# Altium project Wolf-Lite_UM.PrjPCB
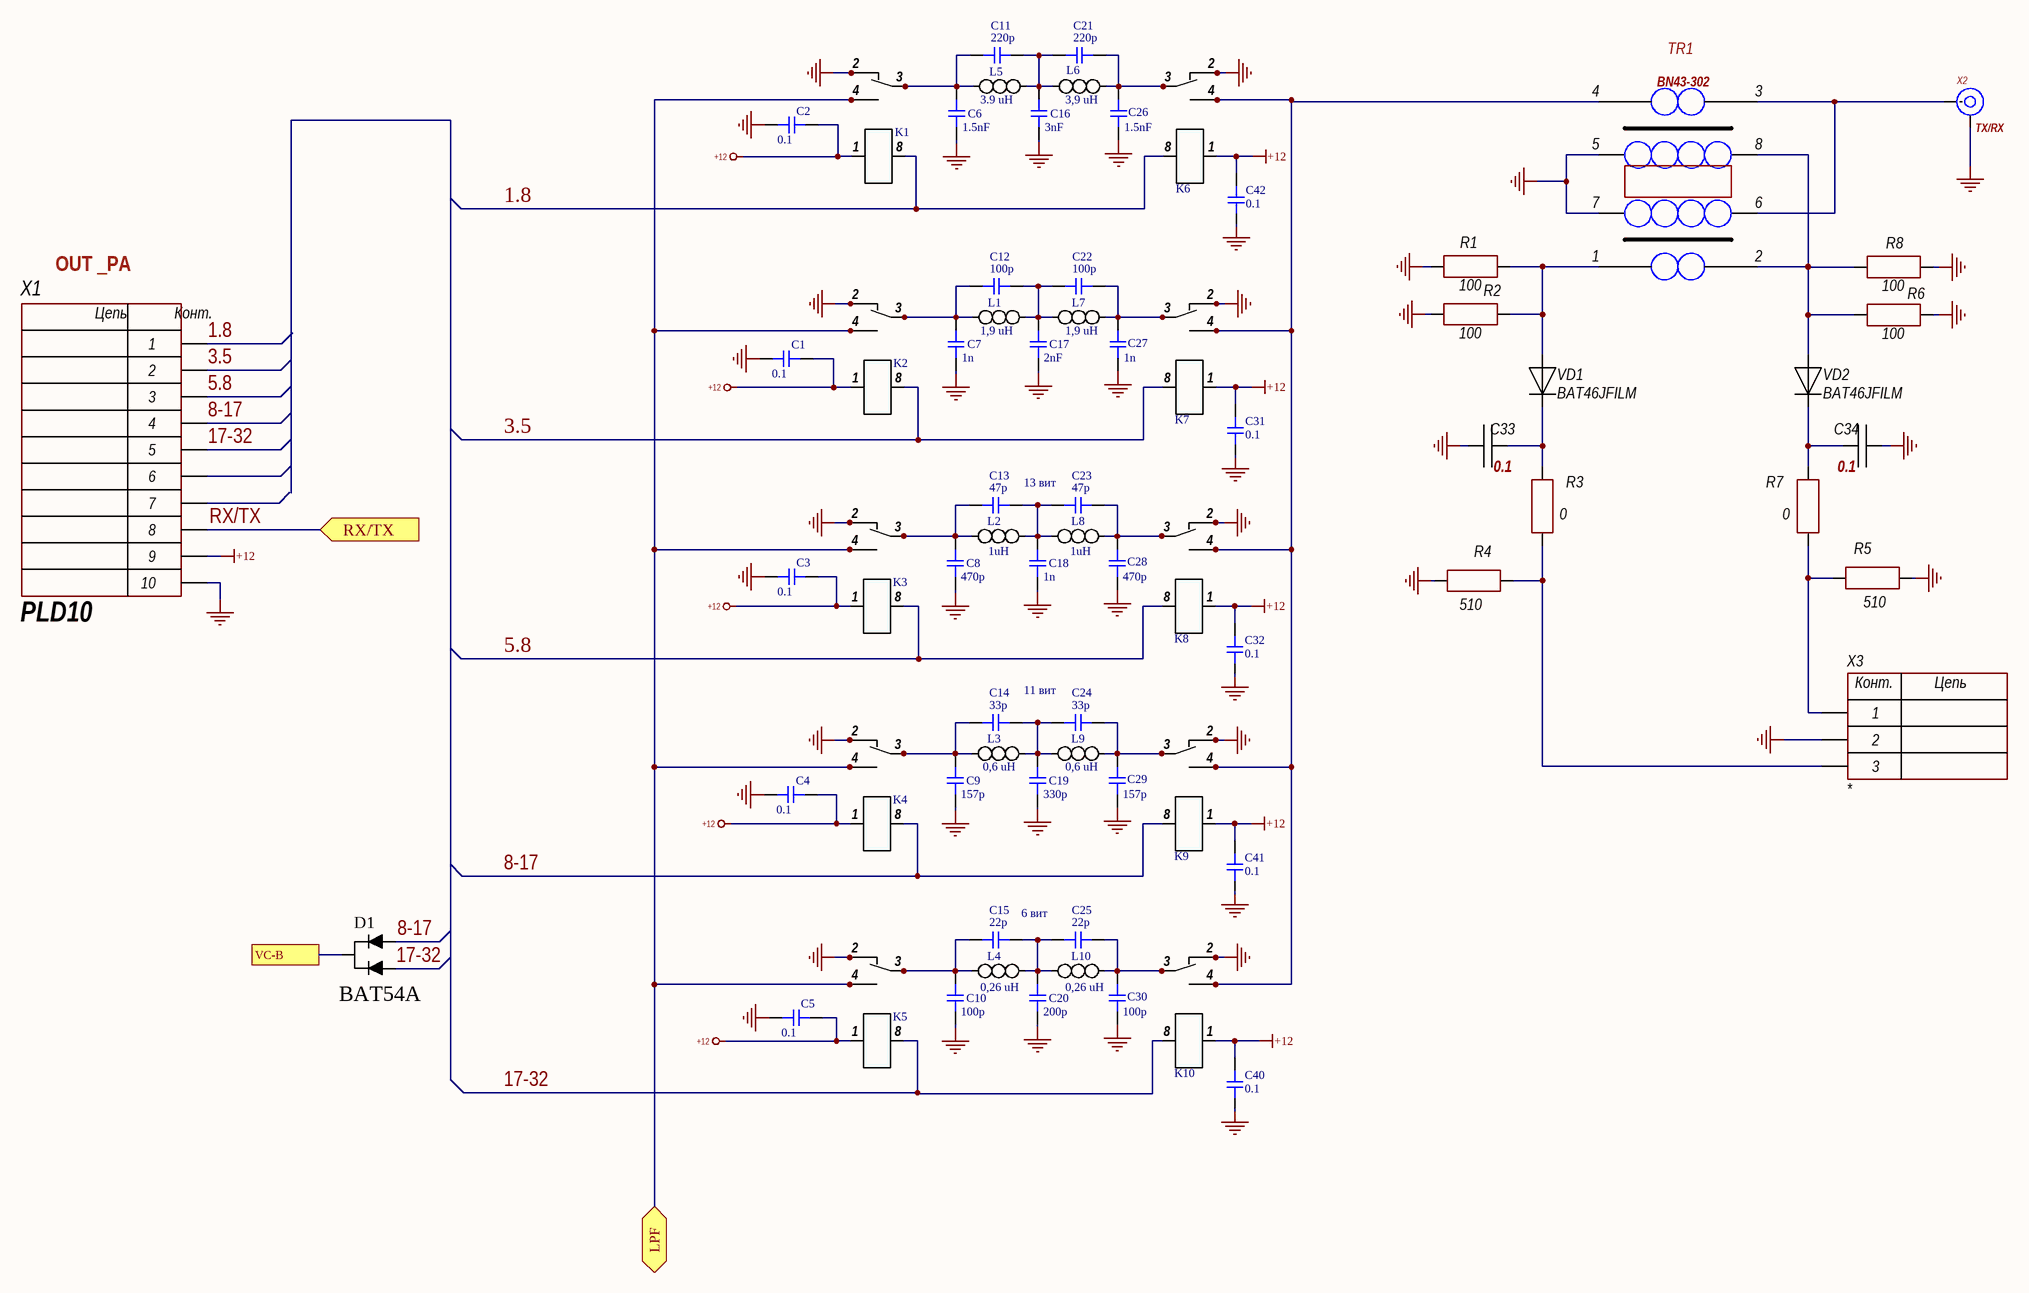
[diagram p0: Wolf-Lite_LPF.SchDoc]
2 sheets, 150 parts. Net scope: flat (ports and power ports of the same name join across sheets).
Board file: Wolf-Lite_UM.PcbDoc
Sheets:
  Wolf-Lite_LPF.SchDoc
  Wolf-Lite_UM.SchDoc

## Sheet Wolf-Lite_LPF.SchDoc
size 594 x 420 mm; Address1: Address1; Address2: Address2; Address3: Address3; Address4: Address4; DocumentNumber: АБВГ.123456.001 Э3; SheetNumber: 2; Scale: 1:1; DocumentType: Схема электрическая принципиальная; FirstReferrence: АБВГ.123456.001

### Parts
(Parts that share a designator on the sheet are numbered #1, #2 ... from top to bottom, then left to right.)
C1  0.1  [CH0805C]
C2  0.1  [CH0805C]
C3  0.1  [CH0805C]
C4  0.1  [CH0805C]
C5  0.1  [CH0805C]
C6  1.5nF  [CH1206C]
C7  1n  [CH1206C]
C8  470p  [CH1206C]
C9  157p  [CH1206C]
C10  100p  [CH1206C]
C11  220p  [CH1206C]
C12  100p  [CH1206C]
C13  47p  [CH1206C]
C14  33p  [CH1206C]
C15  22p  [CH1206C]
C16  3nF  [CH1206C]
C17  2nF  [CH1206C]
C18  1n  [CH1206C]
C19  330p  [CH1206C]
C20  200p  [CH1206C]
C21  220p  [CH1206C]
C22  100p  [CH1206C]
C23  47p  [CH1206C]
C24  33p  [CH1206C]
C25  22p  [CH1206C]
C26  1.5nF  [CH1206C]
C27  1n  [CH1206C]
C28  470p  [CH1206C]
C29  157p  [CH1206C]
C30  100p  [CH1206C]
C31  0.1  [CH0805C]
C32  0.1  [CH0805C]
C33  0.1  [CH0805C]
C34  0.1  [CH0805C]
C40  0.1  [CH0805C]
C41  0.1  [CH0805C]
C42  0.1  [CH0805C]
D1  BAT54A  [SOT23_132]
K1  Relay_IM06 GR 12v to BPF  [IM06]  (value not drawn)
K2  Relay_IM06 GR 12v to BPF  [IM06]  (value not drawn)
K3  Relay_IM06 GR 12v to BPF  [IM06]  (value not drawn)
K4  Relay_IM06 GR 12v to BPF  [IM06]  (value not drawn)
K5  Relay_IM06 GR 12v to BPF  [IM06]  (value not drawn)
K6  Relay_IM06 GR 12v to BPF  [IM06]  (value not drawn)
K7  Relay_IM06 GR 12v to BPF  [IM06]  (value not drawn)
K8  Relay_IM06 GR 12v to BPF  [IM06]  (value not drawn)
K9  Relay_IM06 GR 12v to BPF  [IM06]  (value not drawn)
K10  Relay_IM06 GR 12v to BPF  [IM06]  (value not drawn)
L1  1,9 uH  [T50-2]
L2  1uH  [T50-6]
L3  0,6 uH  [T50-6]
L4  0,26 uH  [T50-6]
L5  3.9 uH  [T50-2]
L6  3,9 uH  [T50-2]
L7  1,9 uH  [T50-2]
L8  1uH  [T50-6]
L9  0,6 uH  [T50-6]
L10  0,26 uH  [T50-6]
R1  100  [CH1206R]
R2  100  [CH1206R]
R3  0  [CH0805R]
R4  510  [CH0805R]
R5  510  [CH0805R]
R6  100  [CH1206R]
R7  0  [CH0805R]
R8  100  [CH1206R]
TR1  BN43-302  [TANDEM]
VD1  BAT46JFILM  [D9B]
VD2  BAT46JFILM  [D9B]
X1#1  PLD10  [CON: PLD-10]
X2  TX/RX  [Connect]
X3  *  [CON: CWF-3]

### Ports
LPF (bidir), RX/TX (in), VC-B

### Nets
+12: C1.2 C2.2 C3.2 C4.2 C5.2 C31.2 C32.2 C40.2 C41.2 C42.2 K1.1 K2.1 K3.1 K4.1 K5.1 K6.1 K7.1 K8.1 K9.1 K10.1 X1#1.9
GND: C1.1 C2.1 C3.1 C4.1 C5.1 C6.2 C7.2 C8.2 C9.2 C10.2 C16.2 C17.2 C18.2 C19.2 C20.2 C26.2 C27.2 C28.2 C29.2 C30.2 C31.1 C32.1 C33.2 C34.2 C40.1 C41.1 C42.1 K1.2 K1.7 K2.2 K2.7 K3.2 K3.7 K4.2 K4.7 K5.2 K5.7 K6.2 K6.7 K7.2 K7.7 K8.2 K8.7 K9.2 K9.7 K10.2 K10.7 R1.2 R2.2 R4.1 R5.1 R6.2 R8.2 TR1.5 TR1.7 X1#1.10 X2.2(IN) X3.2
1.8: K1.8 K6.8 X1#1.1
3.5: K2.8 K7.8 X1#1.2
5.8: K3.8 K8.8 X1#1.3
8-17: D1.1 K4.8 K9.8 X1#1.4
17-32: D1.2 K5.8 K10.8 X1#1.5
LPF: K1.4 K1.5 K2.4 K2.5 K3.4 K3.5 K4.4 K4.5 K5.4 K5.5 ; port LPF
RX/TX: X1#1.8 ; port RX/TX
NetC6_1: C6.1 C11.2 K1.3 K1.6 L5.1
NetC7_1: C7.1 C12.2 K2.3 K2.6 L1.1
NetC8_1: C8.1 C13.2 K3.3 K3.6 L2.1
NetC9_1: C9.1 C14.2 K4.3 K4.6 L3.1
NetC10_1: C10.1 C15.2 K5.3 K5.6 L4.1
NetC11_1: C11.1 C16.1 C21.2 L5.2 L6.1
NetC12_1: C12.1 C17.1 C22.2 L1.2 L7.1
NetC13_1: C13.1 C18.1 C23.2 L2.2 L8.1
NetC14_1: C14.1 C19.1 C24.2 L3.2 L9.1
NetC15_1: C15.1 C20.1 C25.2 L4.2 L10.1
NetC21_1: C21.1 C26.1 K6.3 K6.6 L6.2
NetC22_1: C22.1 C27.1 K7.3 K7.6 L7.2
NetC23_1: C23.1 C28.1 K8.3 K8.6 L8.2
NetC24_1: C24.1 C29.1 K9.3 K9.6 L9.2
NetC25_1: C25.1 C30.1 K10.3 K10.6 L10.2
NetC33_1: C33.1 R3.1 VD1.2
NetC34_1: C34.1 R7.1 VD2.2
NetC78_1: D1.3 ; port VC-B
NetK6_4: K6.4 K6.5 K7.4 K7.5 K8.4 K8.5 K9.4 K9.5 K10.4 K10.5 TR1.4
NetR1_1: R1.1 R2.1 TR1.1 VD1.1
NetR3_2: R3.2 R4.2 X3.3
NetR5_2: R5.2 R7.2 X3.1
NetR6_1: R6.1 R8.1 TR1.2 TR1.8 VD2.1
NetTR1_3: TR1.3 TR1.6 X2.1(IN)

Not connected (* = marked no-connect by the designer): X1#1 6 7

### Notes on the sheet
- OUT _PA
- 13 вит
- 11 вит
- 6 вит
- Перв. примен.
- Справ. №
- Подп. и дата
- Инв. № дубл.
- Взам. инв. №
- Инв. № подл.
- Изм.
- Лист
- № докум.
- Подп.
- Дата
- 2.106-A2
- Копировал
- Формат А2
- (in symbol 3-Connector) Конт.; Цепь
- (in symbol 10-Connector) Цепь; Конт.

### Library data of the parts
C1-C32 C40-C42 = C_smd
C33 C34 = Capacitor: Manufacturer: *; Model: *; HelpURL: *; ComponentKind: *; Value: *
D1 = BAT54
L1-L10 = L
R1-R8 = Resistor: Manufacturer: *; Model: *; HelpURL: *; ComponentKind: *; Value: *
VD1 VD2 = Diod: ComponentKind: *; Manufacturer: *; Model: *; HelpURL: *
X1#1 = 10-Connector: Model: *; Manufacturer: *; HelpURL: *; ComponentKind: *
X2 = SMA: RF; System: Connector; Model: *; Manufacturer: *; HelpURL: *; ComponentKind: *
X3 = 3-Connector: Model: *; Manufacturer: *; HelpURL: *; ComponentKind: *

## Sheet Wolf-Lite_UM.SchDoc
size A3; Address1: Address1; Address2: Address2; Address3: Address3; Address4: Address4; DocumentNumber: АБВГ.123456.001 Э3; SheetNumber: 1; Scale: 1:1; DocumentType: Схема электрическая принципиальная; FirstReferrence: АБВГ.123456.001
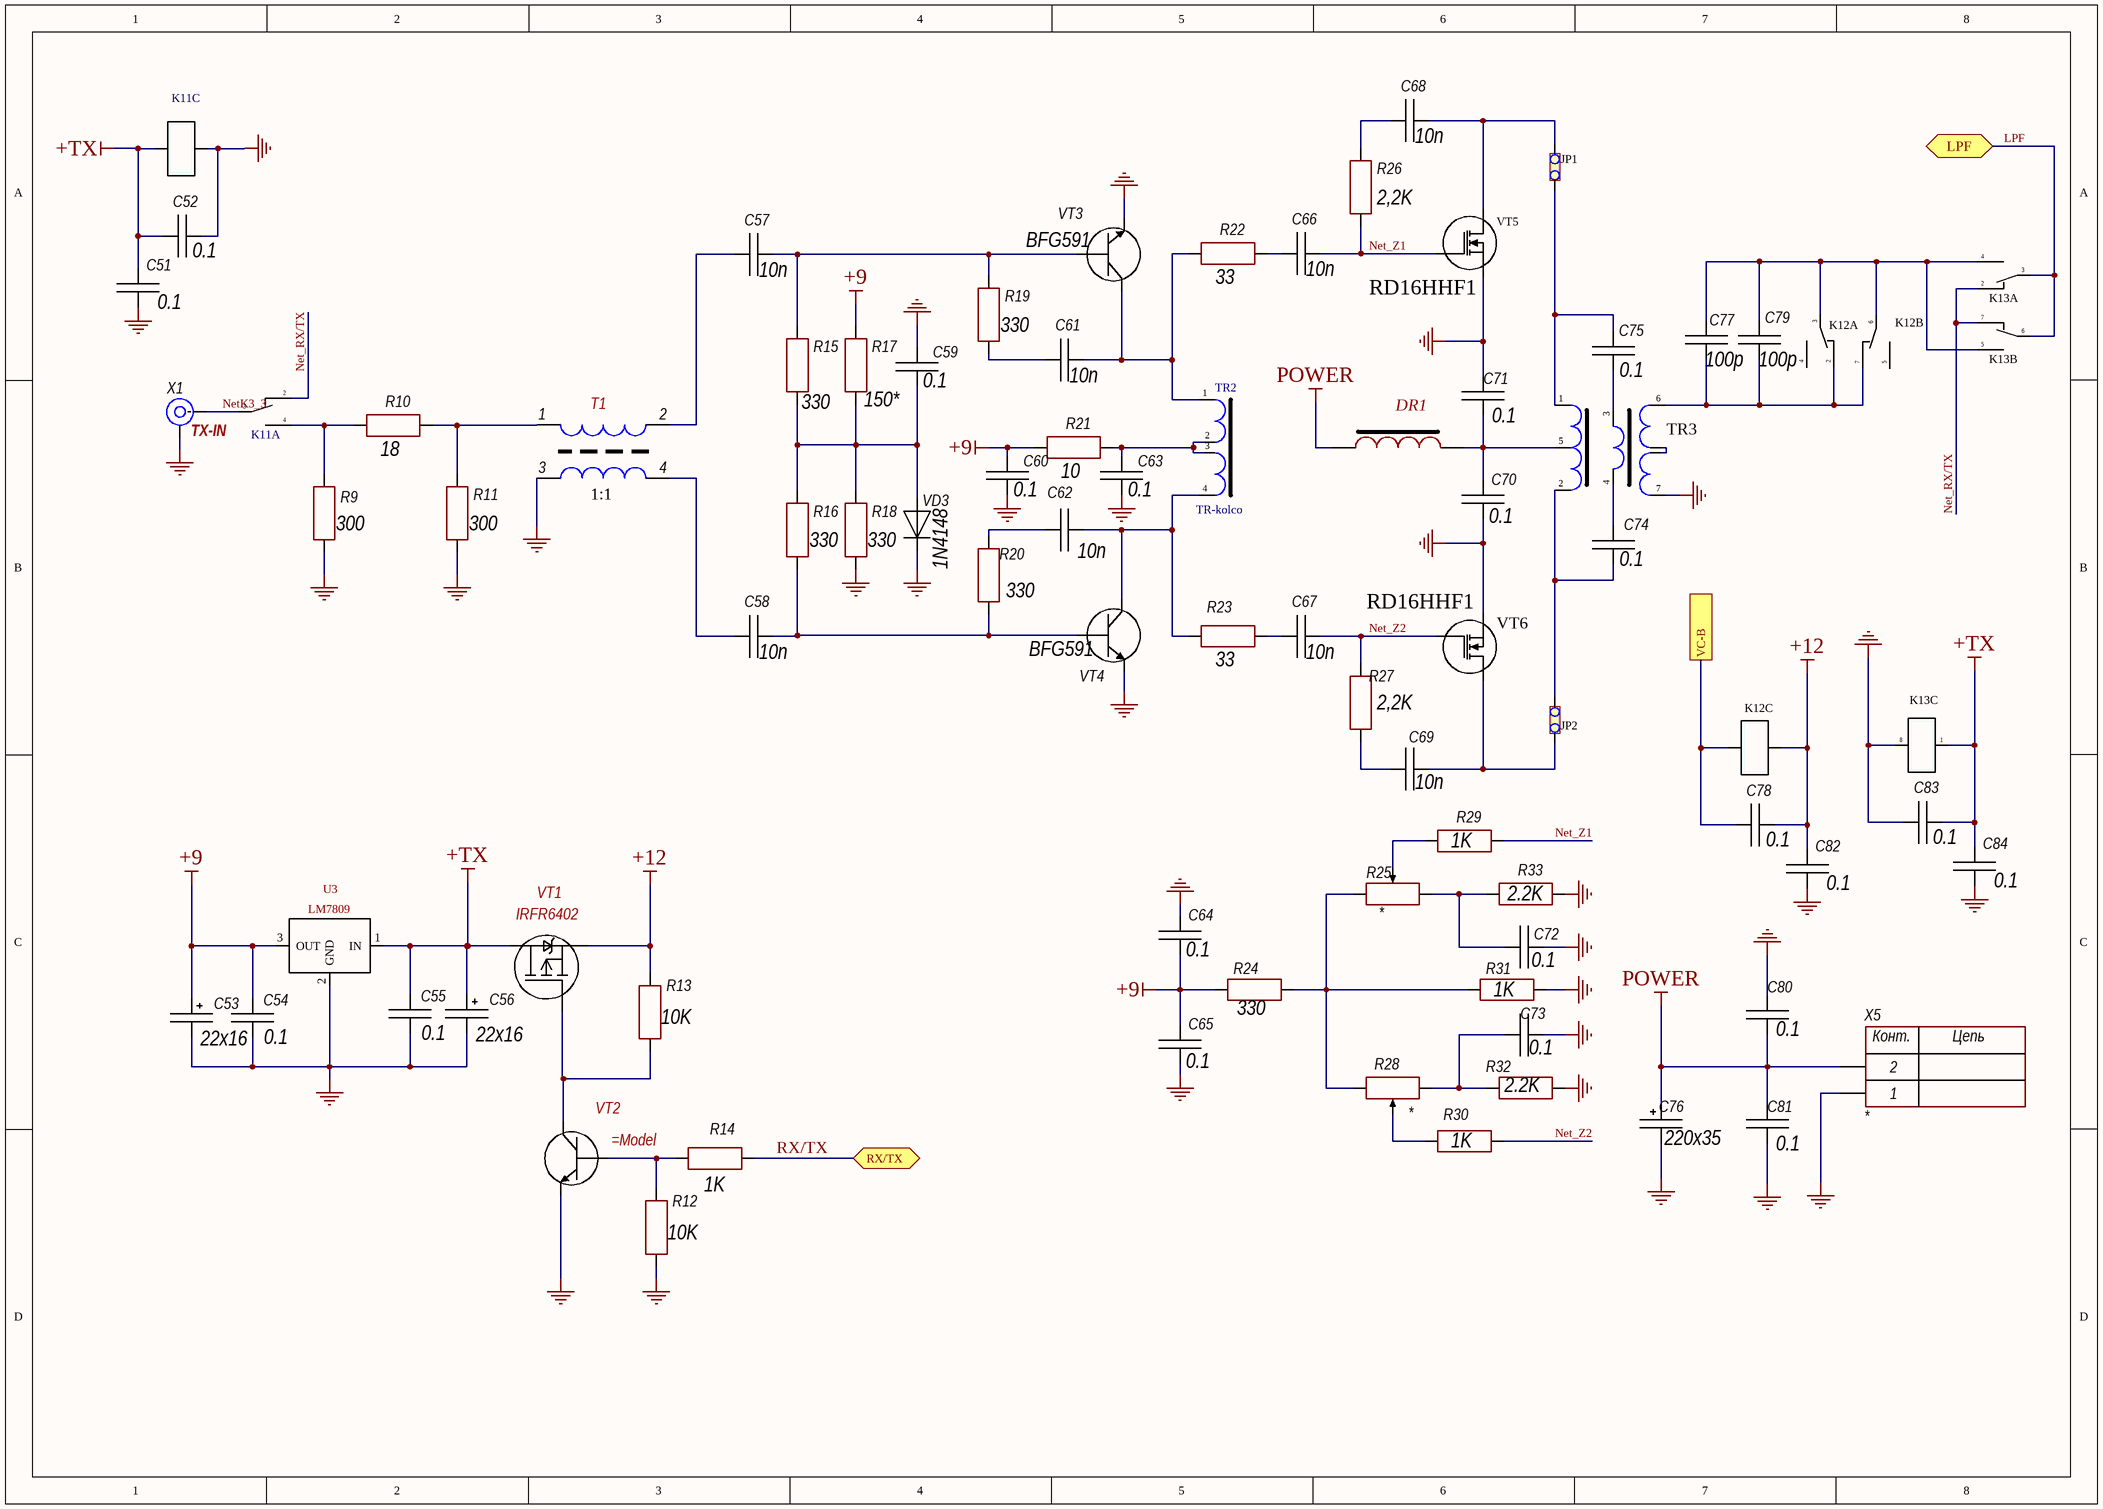
[diagram p1: Wolf-Lite_UM.SchDoc]

### Parts
(Parts that share a designator on the sheet are numbered #1, #2 ... from top to bottom, then left to right.)
C51  0.1  [CH0805C]
C52  0.1  [CH0805C]
C53  22x16  [TANTAL_B]
C54  0.1  [CH0805C]
C55  0.1  [CH0805C]
C56  22x16  [TANTAL_B]
C57  10n  [CH0805C]
C58  10n  [CH0805C]
C59  0.1  [CH0805C]
C60  0.1  [CH0805C]
C61  10n  [CH0805C]
C62  10n  [CH0805C]
C63  0.1  [CH0805C]
C64  0.1  [CH0805C]
C65  0.1  [CH0805C]
C66  10n  [CH0805C]
C67  10n  [CH0805C]
C68  10n  [CH1206C]
C69  10n  [CH1206C]
C70  0.1  [CH0805C]
C71  0.1  [CH0805C]
C72  0.1  [CH0805C]
C73  0.1  [CH0805C]
C74  0.1  [CH1206C]
C75  0.1  [CH1206C]
C76  220x35  [D8C3.2H12]
C77  100p  [CH1206C]
C78  0.1  [CH0805C]
C79  100p  [CH1206C]
C80  0.1  [CH0805C]
C81  0.1  [CH0805C]
C82  0.1  [CH0805C]
C83  0.1  [CH0805C]
C84  0.1  [CH0805C]
DR1  10uH  [DR2]  (value not drawn)
JP1  JP1  [CON: PLS-2]  (value not drawn)
JP2  JP2  [CON: PLS-2]  (value not drawn)
K11  IM06  [IMG06]  (value not drawn)  (parts A,C of 3)
K12  IM06  [IMG06]  (value not drawn)  (parts A,B,C of 3)
K13  IM06  [IMG06]  (value not drawn)  (parts A,B,C of 3)
R9  300  [CH0805R]
R10  18  [CH0805R]
R11  300  [CH0805R]
R12  10K  [CH0805R]
R13  10K  [CH0805R]
R14  1K  [CH0805R]
R15  330  [CH0805R]
R16  330  [CH0805R]
R17  150*  [CH0805R]
R18  330  [CH0805R]
R19  330  [CH0805R]
R20  330  [CH0805R]
R21  10  [CH0805R]
R22  33  [CH0805R]
R23  33  [CH0805R]
R24  330  [CH0805R]
R25  *  [RES: 3296W]
R26  2,2K  [CH1206R]
R27  2,2K  [CH1206R]
R28  *  [RES: 3296W]
R29  1K  [CH0805R]
R30  1K  [CH0805R]
R31  1K  [CH0805R]
R32  2.2K  [CH0805R]
R33  2.2K  [CH0805R]
T1  BN-43-302  [FT-37-43]  (value not drawn)
TR2  TR-kolco  [TR-Kolco]
TR3  TR-UM  [TR-UM]  (value not drawn)
U3  LM7809  [DPAK]
VD3  1N4148  [SOD123]
VT1  IRFR6402  [SOT23_132]
VT2  (no value)  [SOT23_123]
VT3  BFG591  [BFG]
VT4  BFG591  [BFG]
VT5  RD16HHF1  [rd16]
VT6  RD16HHF1  [rd16]
X1#2  TX-IN  [CON: SMA]
X5  *  [CON: 300-02P-5.0]

### Ports
LPF (bidir), RX/TX (bidir), VC-B

### Nets
+9: C53.1 C54.2 C60.2 C64.1 C65.1 R17.2 R21.1 R24.1 U3.3(OUT)
+12: C78.2 C82.2 K12.1 R13.2 VT1.2(I)
+TX: C51.2 C52.1 C55.2 C56.1 C83.2 C84.2 K11.1 K13.1 U3.1(IN) VT1.3(Сток(Drain))
GND: C51.1 C52.2 C53.2 C54.1 C55.1 C56.2 C59.2 C60.1 C63.1 C64.2 C65.2 C70.2 C71.2 C72.1 C73.1 C76.2 C80.1 C81.1 C82.1 C83.1 C84.1 K11.8 K13.8 R9.1 R11.1 R12.1 R18.1 R31.2 R32.2 R33.2 T1.3 TR3.7 U3.2(GND) VD3.2 VT2.3(E) VT3.3(E) VT4.3(E) VT5.2(S) VT6.2(S) X1#2.2(IN) X5.1
POWER: C76.1 C80.2 C81.2 DR1.2 X5.2
LPF: K13.3 K13.6 ; port LPF
Net_RX/TX: K11.2 K13.2 K13.7
Net_Z1: C66.2 R26.1 R29.2 VT5.1(G)
Net_Z2: C67.2 R27.1 R30.2 VT6.1(G)
NetK3_3: K11.3 X1#2.1(IN)
RX/TX: R14.1 ; port RX/TX
NetC57_1: C57.1 T1.2
NetC57_2: C57.2 R15.2 R19.2 VT3.2(B)
NetC58_1: C58.1 T1.4
NetC58_2: C58.2 R16.1 R20.2 VT4.2(B)
NetC59_1: C59.1 R15.1 R16.2 R17.1 R18.2 VD3.1
NetC61_1: C61.1 R19.1
NetC61_2: C61.2 R22.1 TR2.1 VT3.1(C)
NetC62_1: C62.1 R20.1
NetC62_2: C62.2 R23.1 TR2.4 VT4.1(C)
NetC63_2: C63.2 R21.2 TR2.2 TR2.3
NetC66_1: C66.1 R22.2
NetC67_1: C67.1 R23.2
NetC68_1: C68.1 R26.2
NetC68_2: C68.2 JP1.1 VT5.3(D)
NetC69_1: C69.1 R27.2
NetC69_2: C69.2 JP2.1 VT6.3(D)
NetC70_1: C70.1 C71.1 DR1.1 TR3.5
NetC72_2: C72.2 R25.3 R33.1
NetC73_2: C73.2 R28.3 R32.1
NetC74_1: C74.1 JP2.2 TR3.2
NetC74_2: C74.2 TR3.4
NetC75_1: C75.1 JP1.2 TR3.1
NetC75_2: C75.2 TR3.3
NetC77_1: C77.1 C79.1 K12.3 K12.6 K13.4 K13.5
NetC77_2: C77.2 C79.2 K12.2 K12.7 TR3.6
NetC78_1: C78.1 K12.8 ; port VC-B
NetK11_4: K11.4 R9.2 R10.1
NetR10_2: R10.2 R11.2 T1.1
NetR12_2: R12.2 R14.2 VT2.1(B)
NetR13_1: R13.1 VT1.1(Затвор(Gate)) VT2.2(C)
NetR24_2: R24.2 R25.1 R28.1 R31.1
NetR25_2: R25.2 R29.1
NetR28_2: R28.2 R30.1
NetTR3_8: TR3.8 TR3.9

Not connected (* = marked no-connect by the designer): K12 4 5

### Notes on the sheet
- (near T1) 1:1
- Title
- Size:
- Date:
- A3
- Number:
- Time:
- Revision:
- Sheet
- of
- File:
- (in symbol 2-Connector) Конт.; Цепь

### Library data of the parts
C51 C52 C54 C55 C57-C75 C77-C84 = Capacitor: Manufacturer: *; Model: *; HelpURL: *; ComponentKind: *; Value: *
C53 C56 C76 = AlumCap: Manufacturer: *; Model: *; HelpURL: *; ComponentKind: *; Value: *
DR1 = Inductor-1
JP1 = JP2
K11-K13 = IM06-1
R9-R24 R26 R27 R29-R33 = Resistor: Manufacturer: *; Model: *; HelpURL: *; ComponentKind: *; Value: *
R25 R28 = ADJ resistor: Manufacturer: *; Model: *; HelpURL: *; ComponentKind: *; Value: *
U3 = Kren_5
VD3 = Diod: ComponentKind: *; Manufacturer: *; Model: *; HelpURL: *
VT1 = P-KANAL
VT2-VT4 = N-P-N
VT5 VT6 = N
X1#2 = SMA: RF; System: Connector; Model: *; Manufacturer: *; HelpURL: *; ComponentKind: *
X5 = 2-Connector: Model: *; Manufacturer: *; HelpURL: *; ComponentKind: *

## Nets that join several sheets
+12: Wolf-Lite_LPF (21 pins), Wolf-Lite_UM (5 pins)
GND: Wolf-Lite_LPF (58 pins), Wolf-Lite_UM (41 pins)
LPF: Wolf-Lite_LPF (10 pins), Wolf-Lite_UM (K13.3 K13.6)
NetC78_1: Wolf-Lite_LPF (D1.3), Wolf-Lite_UM (C78.1 K12.8)
RX/TX: Wolf-Lite_LPF (X1#1.8), Wolf-Lite_UM (R14.1)